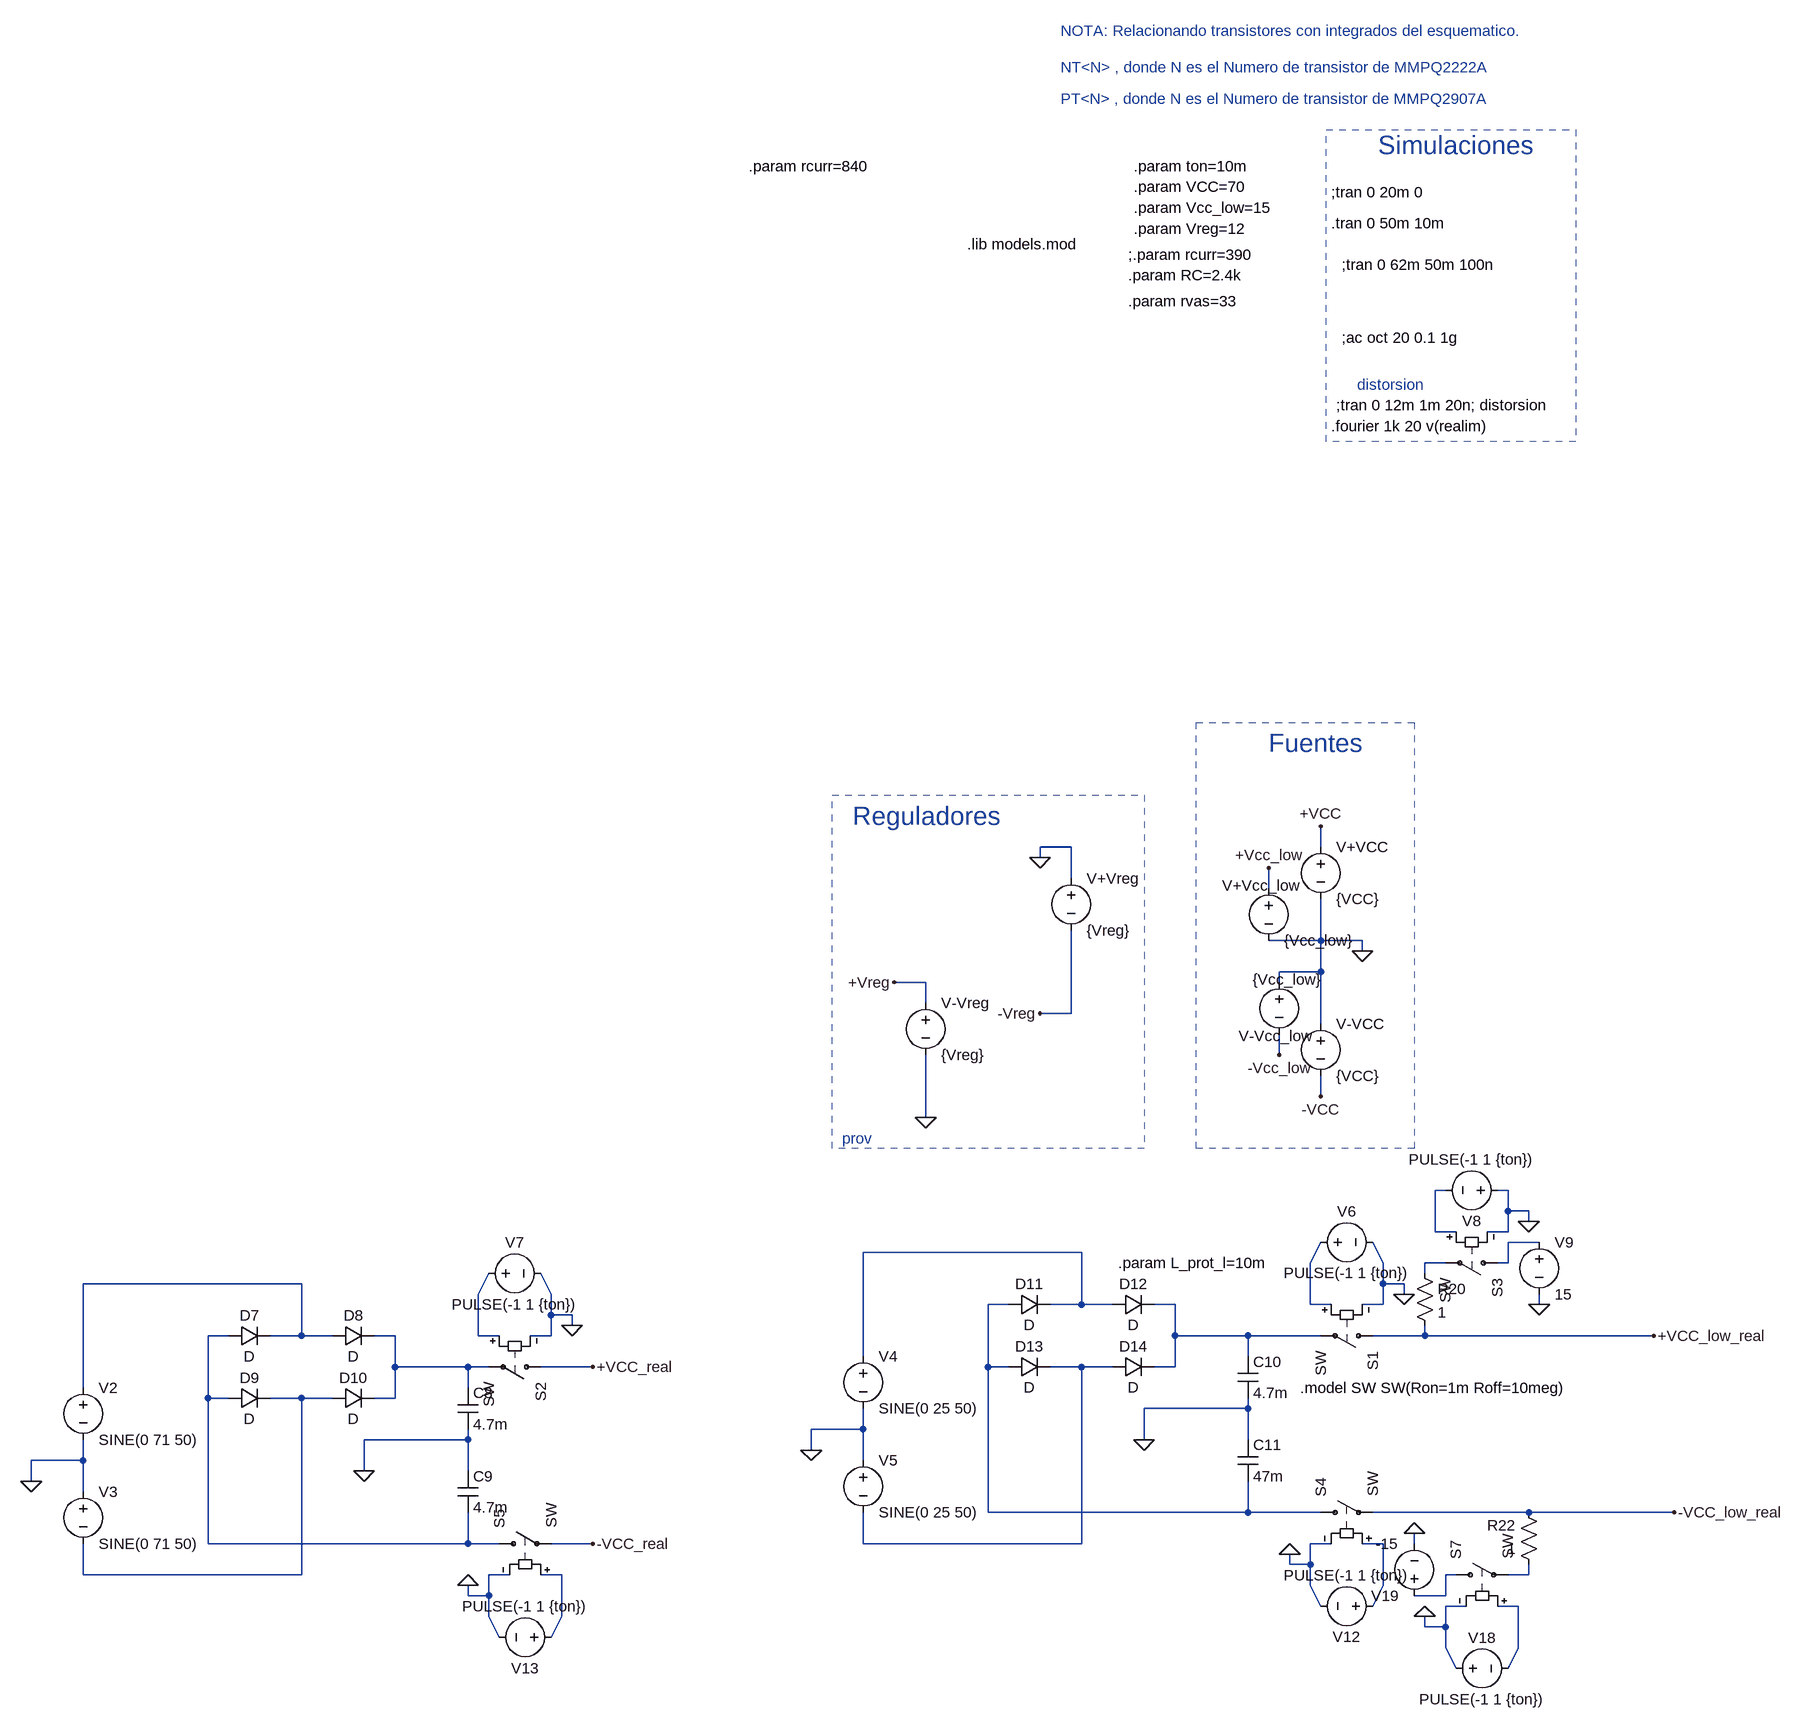
[diagram p0: schematic fuentes.asc]
fuentes.asc, the LTspice schematic file:
Version 4
SHEET 1 6132 2164
WIRE -1568 448 -1616 448
WIRE -1184 448 -1184 416
WIRE -1616 464 -1616 448
WIRE -1568 496 -1568 448
WIRE -1264 512 -1264 480
WIRE -1184 592 -1184 528
WIRE -1184 592 -1264 592
WIRE -1120 592 -1184 592
WIRE -1120 608 -1120 592
WIRE -1184 640 -1184 592
WIRE -1184 640 -1248 640
WIRE -1792 656 -1840 656
WIRE -1248 656 -1248 640
WIRE -1792 688 -1792 656
WIRE -1568 704 -1568 576
WIRE -1568 704 -1616 704
WIRE -1184 720 -1184 640
WIRE -1248 768 -1248 736
WIRE -1184 832 -1184 800
WIRE -1792 864 -1792 768
WIRE -992 976 -1008 976
WIRE -896 976 -912 976
WIRE -896 1008 -896 976
WIRE -864 1008 -896 1008
WIRE -864 1024 -864 1008
WIRE -1008 1040 -1008 976
WIRE -976 1040 -1008 1040
WIRE -896 1040 -896 1008
WIRE -896 1040 -928 1040
WIRE -848 1056 -896 1056
WIRE -1552 1072 -1888 1072
WIRE -1200 1088 -1184 1056
WIRE -1088 1088 -1104 1056
WIRE -992 1088 -1024 1088
WIRE -896 1088 -896 1056
WIRE -896 1088 -912 1088
WIRE -1024 1104 -1024 1088
WIRE -2752 1120 -3088 1120
WIRE -1088 1120 -1088 1088
WIRE -1056 1120 -1088 1120
WIRE -2480 1136 -2464 1104
WIRE -2368 1136 -2384 1104
WIRE -1056 1136 -1056 1120
WIRE -1664 1152 -1696 1152
WIRE -1552 1152 -1552 1072
WIRE -1552 1152 -1600 1152
WIRE -1504 1152 -1552 1152
WIRE -1408 1152 -1440 1152
WIRE -1200 1152 -1200 1088
WIRE -1168 1152 -1200 1152
WIRE -1088 1152 -1088 1120
WIRE -1088 1152 -1120 1152
WIRE -848 1152 -848 1136
WIRE -2368 1168 -2368 1136
WIRE -2336 1168 -2368 1168
WIRE -2336 1184 -2336 1168
WIRE -2864 1200 -2896 1200
WIRE -2752 1200 -2752 1120
WIRE -2752 1200 -2800 1200
WIRE -2704 1200 -2752 1200
WIRE -2608 1200 -2640 1200
WIRE -2480 1200 -2480 1136
WIRE -2448 1200 -2480 1200
WIRE -2368 1200 -2368 1168
WIRE -2368 1200 -2400 1200
WIRE -1408 1200 -1408 1152
WIRE -1296 1200 -1408 1200
WIRE -1184 1200 -1296 1200
WIRE -1024 1200 -1024 1184
WIRE -1024 1200 -1104 1200
WIRE -672 1200 -1024 1200
WIRE -1888 1232 -1888 1072
WIRE -1296 1232 -1296 1200
WIRE -2608 1248 -2608 1200
WIRE -2496 1248 -2608 1248
WIRE -2464 1248 -2496 1248
WIRE -2304 1248 -2384 1248
WIRE -1696 1248 -1696 1152
WIRE -1664 1248 -1696 1248
WIRE -1552 1248 -1600 1248
WIRE -1504 1248 -1552 1248
WIRE -1408 1248 -1408 1200
WIRE -1408 1248 -1440 1248
WIRE -3088 1280 -3088 1120
WIRE -2496 1280 -2496 1248
WIRE -2896 1296 -2896 1200
WIRE -2864 1296 -2896 1296
WIRE -2752 1296 -2800 1296
WIRE -2704 1296 -2752 1296
WIRE -2608 1296 -2608 1248
WIRE -2608 1296 -2640 1296
WIRE -1296 1312 -1296 1296
WIRE -1296 1312 -1456 1312
WIRE -1888 1344 -1888 1312
WIRE -1888 1344 -1968 1344
WIRE -2496 1360 -2496 1344
WIRE -2496 1360 -2656 1360
WIRE -1456 1360 -1456 1312
WIRE -1296 1360 -1296 1312
WIRE -1968 1376 -1968 1344
WIRE -3088 1392 -3088 1360
WIRE -3088 1392 -3168 1392
WIRE -1888 1392 -1888 1344
WIRE -2656 1408 -2656 1360
WIRE -2496 1408 -2496 1360
WIRE -3168 1424 -3168 1392
WIRE -3088 1440 -3088 1392
WIRE -1696 1472 -1696 1248
WIRE -1296 1472 -1296 1424
WIRE -1296 1472 -1696 1472
WIRE -1184 1472 -1296 1472
WIRE -864 1472 -1104 1472
WIRE -640 1472 -864 1472
WIRE -2896 1520 -2896 1296
WIRE -2496 1520 -2496 1472
WIRE -2496 1520 -2896 1520
WIRE -2448 1520 -2496 1520
WIRE -2304 1520 -2368 1520
WIRE -1888 1520 -1888 1472
WIRE -1552 1520 -1552 1248
WIRE -1552 1520 -1888 1520
WIRE -1168 1520 -1200 1520
WIRE -1088 1520 -1120 1520
WIRE -1040 1520 -1040 1504
WIRE -1232 1552 -1232 1536
WIRE -1200 1552 -1200 1520
WIRE -1200 1552 -1232 1552
WIRE -3088 1568 -3088 1520
WIRE -2752 1568 -2752 1296
WIRE -2752 1568 -3088 1568
WIRE -2432 1568 -2464 1568
WIRE -2352 1568 -2384 1568
WIRE -976 1568 -992 1568
WIRE -864 1568 -864 1552
WIRE -864 1568 -896 1568
WIRE -1200 1584 -1200 1552
WIRE -1088 1584 -1088 1520
WIRE -2496 1600 -2496 1584
WIRE -2464 1600 -2464 1568
WIRE -2464 1600 -2496 1600
WIRE -992 1600 -992 1568
WIRE -992 1600 -1040 1600
WIRE -1184 1616 -1200 1584
WIRE -1104 1616 -1088 1584
WIRE -960 1616 -992 1616
WIRE -880 1616 -912 1616
WIRE -2464 1632 -2464 1600
WIRE -2352 1632 -2352 1568
WIRE -1024 1648 -1024 1632
WIRE -992 1648 -992 1616
WIRE -992 1648 -1024 1648
WIRE -2448 1664 -2464 1632
WIRE -2368 1664 -2352 1632
WIRE -992 1680 -992 1648
WIRE -880 1680 -880 1616
WIRE -976 1712 -992 1680
WIRE -896 1712 -880 1680
FLAG -1120 608 0
FLAG -1184 416 +VCC
FLAG -1264 480 +Vcc_low
FLAG -1248 768 -Vcc_low
FLAG -1184 832 -VCC
FLAG -1840 656 +Vreg
FLAG -1616 704 -Vreg
FLAG -1792 864 0
FLAG -1616 464 0
FLAG -3168 1424 0
FLAG -2656 1408 0
FLAG -2304 1248 +VCC_real
FLAG -2304 1520 -VCC_real
FLAG -1968 1376 0
FLAG -1456 1360 0
FLAG -672 1200 +VCC_low_real
FLAG -1056 1136 0
FLAG -2336 1184 0
FLAG -864 1024 0
FLAG -848 1152 0
FLAG -1232 1536 0
FLAG -2496 1584 0
FLAG -1024 1632 0
FLAG -1040 1504 0
FLAG -640 1472 -VCC_low_real
SYMBOL voltage -1248 640 R0
WINDOW 0 -62 99 Left 2
WINDOW 3 -41 12 Left 2
WINDOW 123 0 0 Left 2
WINDOW 39 0 0 Left 2
SYMATTR InstName V-Vcc_low
SYMATTR Value {Vcc_low}
SYMBOL voltage -1184 432 R0
WINDOW 123 0 0 Left 2
WINDOW 39 0 0 Left 2
SYMATTR InstName V+VCC
SYMATTR Value {VCC}
SYMBOL voltage -1264 496 R0
WINDOW 0 -72 11 Left 2
WINDOW 123 0 0 Left 2
WINDOW 39 0 0 Left 2
SYMATTR InstName V+Vcc_low
SYMATTR Value {Vcc_low}
SYMBOL voltage -1184 704 R0
WINDOW 123 0 0 Left 2
WINDOW 39 0 0 Left 2
SYMATTR InstName V-VCC
SYMATTR Value {VCC}
SYMBOL voltage -1568 480 R0
WINDOW 123 0 0 Left 2
WINDOW 39 0 0 Left 2
SYMATTR InstName V+Vreg
SYMATTR Value {Vreg}
SYMBOL voltage -1792 672 R0
WINDOW 123 0 0 Left 2
WINDOW 39 0 0 Left 2
SYMATTR InstName V-Vreg
SYMATTR Value {Vreg}
SYMBOL voltage -3088 1264 R0
WINDOW 123 0 0 Left 2
WINDOW 39 0 0 Left 2
SYMATTR InstName V2
SYMATTR Value SINE(0 71 50)
SYMBOL diode -2864 1216 R270
WINDOW 0 32 32 VTop 2
WINDOW 3 0 32 VBottom 2
SYMATTR InstName D7
SYMBOL diode -2704 1216 R270
WINDOW 0 32 32 VTop 2
WINDOW 3 0 32 VBottom 2
SYMATTR InstName D8
SYMBOL diode -2864 1312 R270
WINDOW 0 32 32 VTop 2
WINDOW 3 0 32 VBottom 2
SYMATTR InstName D9
SYMBOL diode -2704 1312 R270
WINDOW 0 32 32 VTop 2
WINDOW 3 0 32 VBottom 2
SYMATTR InstName D10
SYMBOL cap -2512 1280 R0
SYMATTR InstName C8
SYMATTR Value 4.7m
SYMBOL voltage -3088 1424 R0
WINDOW 123 0 0 Left 2
WINDOW 39 0 0 Left 2
SYMATTR InstName V3
SYMATTR Value SINE(0 71 50)
SYMBOL cap -2512 1408 R0
SYMATTR InstName C9
SYMATTR Value 4.7m
SYMBOL voltage -1888 1216 R0
WINDOW 123 0 0 Left 2
WINDOW 39 0 0 Left 2
SYMATTR InstName V4
SYMATTR Value SINE(0 25 50)
SYMBOL diode -1664 1168 R270
WINDOW 0 32 32 VTop 2
WINDOW 3 0 32 VBottom 2
SYMATTR InstName D11
SYMBOL diode -1504 1168 R270
WINDOW 0 32 32 VTop 2
WINDOW 3 0 32 VBottom 2
SYMATTR InstName D12
SYMBOL diode -1664 1264 R270
WINDOW 0 32 32 VTop 2
WINDOW 3 0 32 VBottom 2
SYMATTR InstName D13
SYMBOL diode -1504 1264 R270
WINDOW 0 32 32 VTop 2
WINDOW 3 0 32 VBottom 2
SYMATTR InstName D14
SYMBOL cap -1312 1232 R0
SYMATTR InstName C10
SYMATTR Value 4.7m
SYMBOL voltage -1888 1376 R0
WINDOW 123 0 0 Left 2
WINDOW 39 0 0 Left 2
SYMATTR InstName V5
SYMATTR Value SINE(0 25 50)
SYMBOL cap -1312 1360 R0
SYMATTR InstName C11
SYMATTR Value 47m
SYMBOL sw -1088 1200 R90
SYMATTR InstName S1
SYMBOL voltage -1200 1056 R270
WINDOW 0 32 56 VTop 2
WINDOW 3 -32 56 VBottom 2
WINDOW 123 0 0 Left 2
WINDOW 39 0 0 Left 2
SYMATTR InstName V6
SYMATTR Value PULSE(-1 1 {ton})
SYMBOL sw -2368 1248 R90
SYMATTR InstName S2
SYMBOL voltage -2480 1104 R270
WINDOW 0 32 56 VTop 2
WINDOW 3 -32 56 VBottom 2
WINDOW 123 0 0 Left 2
WINDOW 39 0 0 Left 2
SYMATTR InstName V7
SYMATTR Value PULSE(-1 1 {ton})
SYMBOL sw -896 1088 R90
SYMATTR InstName S3
SYMBOL voltage -896 976 R90
WINDOW 0 32 56 VTop 2
WINDOW 3 -32 56 VBottom 2
WINDOW 123 0 0 Left 2
WINDOW 39 0 0 Left 2
SYMATTR InstName V8
SYMATTR Value PULSE(-1 1 {ton})
SYMBOL voltage -848 1040 R0
WINDOW 123 0 0 Left 2
WINDOW 39 0 0 Left 2
SYMATTR InstName V9
SYMATTR Value 15
SYMBOL res -1040 1088 R0
SYMATTR InstName R20
SYMATTR Value 1
SYMBOL sw -1200 1472 R270
SYMATTR InstName S4
SYMBOL voltage -1088 1616 R90
WINDOW 0 32 56 VTop 2
WINDOW 3 -32 56 VBottom 2
WINDOW 123 0 0 Left 2
WINDOW 39 0 0 Left 2
SYMATTR InstName V12
SYMATTR Value PULSE(-1 1 {ton})
SYMBOL sw -2464 1520 R270
SYMATTR InstName S5
SYMBOL voltage -2352 1664 R90
WINDOW 0 32 56 VTop 2
WINDOW 3 -32 56 VBottom 2
WINDOW 123 0 0 Left 2
WINDOW 39 0 0 Left 2
SYMATTR InstName V13
SYMATTR Value PULSE(-1 1 {ton})
SYMBOL sw -992 1568 R270
SYMATTR InstName S7
SYMBOL voltage -992 1712 R270
WINDOW 0 32 56 VTop 2
WINDOW 3 -32 56 VBottom 2
WINDOW 123 0 0 Left 2
WINDOW 39 0 0 Left 2
SYMATTR InstName V18
SYMATTR Value PULSE(-1 1 {ton})
SYMBOL voltage -1040 1616 R180
WINDOW 123 0 0 Left 2
WINDOW 39 0 0 Left 2
SYMATTR InstName V19
SYMATTR Value -15
SYMBOL res -848 1568 R180
WINDOW 0 36 76 Left 2
WINDOW 3 36 40 Left 2
SYMATTR InstName R22
SYMATTR Value 1
TEXT -1168 -560 Left 2 !;tran 0 20m 0
TEXT -1168 -200 Left 2 !.fourier 1k 20 v(realim)
TEXT -1264 288 Left 4 ;Fuentes
TEXT -1096 -632 Left 4 ;Simulaciones
TEXT -1160 -232 Left 2 !;tran 0 12m 1m 20n; distorsion
TEXT -1128 -264 Left 2 ;distorsion
TEXT -1152 -336 Left 2 !;ac oct 20 0.1 1g
TEXT -1728 -480 Left 2 !.lib models.mod
TEXT -1904 400 Left 4 ;Reguladores
TEXT -1920 896 Left 2 ;prov
TEXT -1584 -752 Left 2 ;NT<N> , donde N es el Numero de transistor de MMPQ2222A
TEXT -1584 -704 Left 2 ;PT<N> , donde N es el Numero de transistor de MMPQ2907A
TEXT -1584 -808 Left 2 ;NOTA: Relacionando transistores con integrados del esquematico.
TEXT -1472 -568 Left 2 !.param VCC=70
TEXT -1472 -536 Left 2 !.param Vcc_low=15
TEXT -1472 -504 Left 2 !.param Vreg=12
TEXT -1496 1088 Left 2 !.param L_prot_l=10m
TEXT -1216 1280 Left 2 !.model SW SW(Ron=1m Roff=10meg)
TEXT -1480 -432 Left 2 !.param RC=2.4k
TEXT -1480 -392 Left 2 !.param rvas=33
TEXT -1480 -464 Left 2 !;.param rcurr=390
TEXT -1168 -512 Left 2 !.tran 0 50m 10m
TEXT -1472 -600 Left 2 !.param ton=10m
TEXT -1152 -448 Left 2 !;tran 0 62m 50m 100n
TEXT -2064 -600 Left 2 !.param rcurr=840
RECTANGLE Normal -1040 912 -1376 256 2
RECTANGLE Normal -792 -176 -1176 -656 2
RECTANGLE Normal -1456 912 -1936 368 2

The netlist it stands for:
* fuentes.asc
V-Vcc_low 0 -Vcc_low {Vcc_low}
V+VCC +VCC 0 {VCC}
V+Vcc_low +Vcc_low 0 {Vcc_low}
V-VCC 0 -VCC {VCC}
V+Vreg 0 -Vreg {Vreg}
V-Vreg +Vreg 0 {Vreg}
V2 N006 0 SINE(0 71 50)
D7 N010 N006 D
D8 N006 N011 D
D9 N010 N013 D
D10 N013 N011 D
C8 N011 0 4.7m
V3 0 N013 SINE(0 71 50)
C9 0 N010 4.7m
V4 N003 0 SINE(0 25 50)
D11 N008 N003 D
D12 N003 N009 D
D13 N008 N012 D
D14 N012 N009 D
C10 N009 0 4.7m
V5 0 N012 SINE(0 25 50)
C11 0 N008 47m
S1 +VCC_low_real N009 N004 0 SW
V6 N004 0 PULSE(-1 1 {ton})
S2 +VCC_real N011 N007 0 SW
V7 N007 0 PULSE(-1 1 {ton})
S3 N002 N005 N001 0 SW
V8 0 N001 PULSE(-1 1 {ton})
V9 N002 0 15
R20 N005 +VCC_low_real 1
S4 N008 -VCC_low_real N014 0 SW
V12 N014 0 PULSE(-1 1 {ton})
S5 N010 -VCC_real N015 0 SW
V13 N015 0 PULSE(-1 1 {ton})
S7 N016 N017 N018 0 SW
V18 0 N018 PULSE(-1 1 {ton})
V19 N016 0 -15
R22 N017 -VCC_low_real 1
.model D D
.lib standard.dio
;tran 0 20m 0
.fourier 1k 20 v(realim)
* Fuentes
* Simulaciones
;tran 0 12m 1m 20n; distorsion
* distorsion
;ac oct 20 0.1 1g
.lib models.mod
* Reguladores
* prov
* NT<N> , donde N es el Numero de transistor de MMPQ2222A
* PT<N> , donde N es el Numero de transistor de MMPQ2907A
* NOTA: Relacionando transistores con integrados del esquematico.
.param VCC=70
.param Vcc_low=15
.param Vreg=12
.param L_prot_l=10m
.model SW SW(Ron=1m Roff=10meg)
.param RC=2.4k
.param rvas=33
;.param rcurr=390
.tran 0 50m 10m
.param ton=10m
;tran 0 62m 50m 100n
.param rcurr=840
.backanno
.end